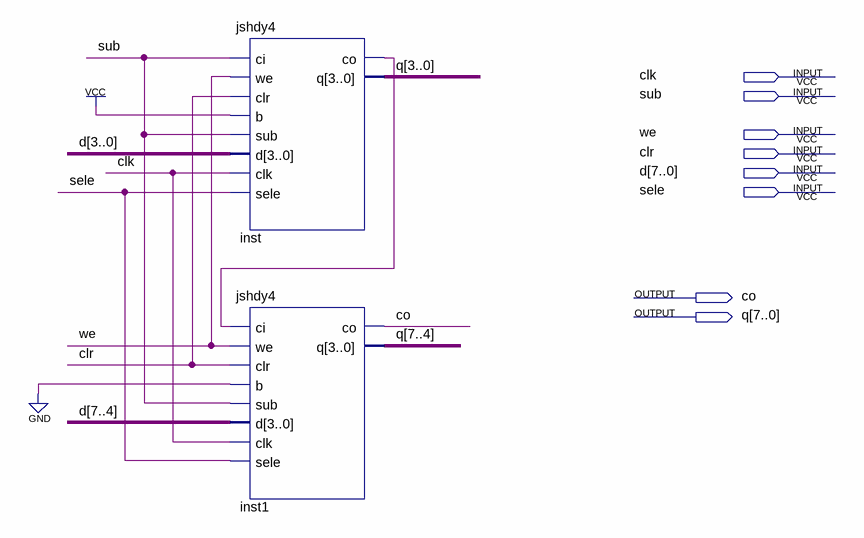
[diagram p0: schematic sheet]
// Quartus schematic jshq8.bdf as structural Verilog: 2 symbols, 8 pins
module jshq8 (
  input  clk,
  input  sub,
  input  we,
  input  clr,
  input  [7:0] d,
  input  sele,
  output co,
  output [7:0] q
);

  wire inst_co;

  jshdy4 inst (
    .ci(sub), .we(we), .clr(clr), .b(1'b1), .sub(sub), .d(d[3:0]), .clk(clk), .sele(sele), .co(inst_co),
    .q(q[3:0]));
  jshdy4 inst1 (
    .ci(inst_co), .we(we), .clr(clr), .b(1'b0), .sub(sub), .d(d[7:4]), .clk(clk), .sele(sele), .co(co),
    .q(q[7:4]));
endmodule
